# Altium project Battery_Charger_LTC4162.PrjPcb
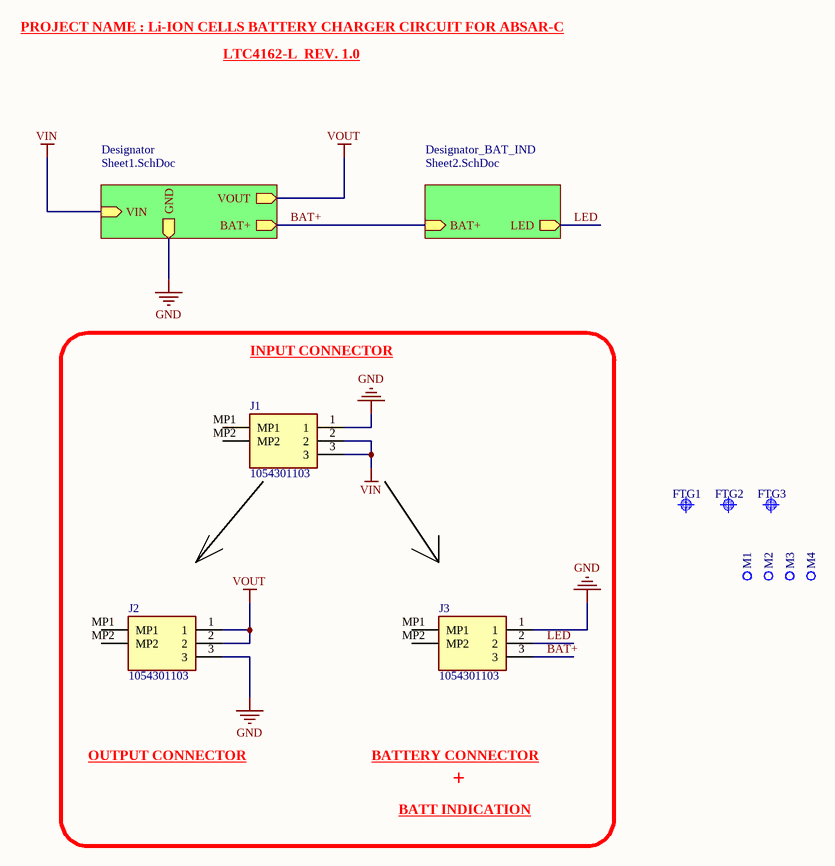
[diagram p0: TOP.SchDoc]
3 sheets, 54 parts. Net scope: hierarchical (ports join the sheet entries above them; power ports are global).
Board files: REV11_PCB_DESIGN_LAYOUT.PcbDoc, Panel_Battery_Charger.PcbDoc
Sheets:
  TOP.SchDoc
    Designator = Sheet1.SchDoc
    Designator_BAT_IND = Sheet2.SchDoc

## Sheet TOP.SchDoc
size A

### Parts
FTG1  Use only in PCB  [Fudicial]  (value not drawn)
FTG2  Use only in PCB  [Fudicial]  (value not drawn)
FTG3  Use only in PCB  [Fudicial]  (value not drawn)
J1  1054301103  [1054301103]
J2  1054301103  [1054301103]
J3  1054301103  [1054301103]
M1  (no value)  [Mounting_pad]
M2  (no value)  [Mounting_pad]
M3  (no value)  [Mounting_pad]
M4  (no value)  [Mounting_pad]

### Blocks framed on the sheet
+: J1-J3

### Sub-sheets
Designator = Sheet1.SchDoc: VIN (in), VOUT (out), GND (out), BAT+ (out)
Designator_BAT_IND = Sheet2.SchDoc: BAT+ (in), LED (out)

### Nets
GND: J1.1 J2.3 J3.1 ; sheet Designator/GND
VIN: J1.2 J1.3 ; sheet Designator/VIN
VOUT: J2.1 J2.2 ; sheet Designator/VOUT
BAT+: J3.3 ; sheet Designator/BAT+, sheet Designator_BAT_IND/BAT+
LED: J3.2 ; sheet Designator_BAT_IND/LED

Not connected (* = marked no-connect by the designer): J1 MP1 MP2; J2 MP1 MP2; J3 MP1 MP2; M1 1; M2 1; M3 1; M4 1

### Notes on the sheet
- PROJECT NAME : Li-ION CELLS BATTERY CHARGER CIRCUIT FOR ABSAR-C
- LTC4162-L  REV. 1.0
- INPUT CONNECTOR
- OUTPUT CONNECTOR
- BATTERY CONNECTOR
- BATT INDICATION

### Library data of the parts
FTG1-FTG3 = Fiducial Target
J1-J3 = 1054301103: Connector; Manufacturer_Name: Molex; Datasheet Link: https://www.molex.com/pdm_docs/sd/1054301103_sd.pdf; Height: 7.19mm; Manufacturer_Part_Number: 1054301103; Mouser Part Number: N/A; Mouser Price/Stock: https://www.mouser.com/Search/Refine.aspx?Keyword=N%2FA
M1-M4 = Through Hole Pad

## Sheet Sheet1.SchDoc
size A
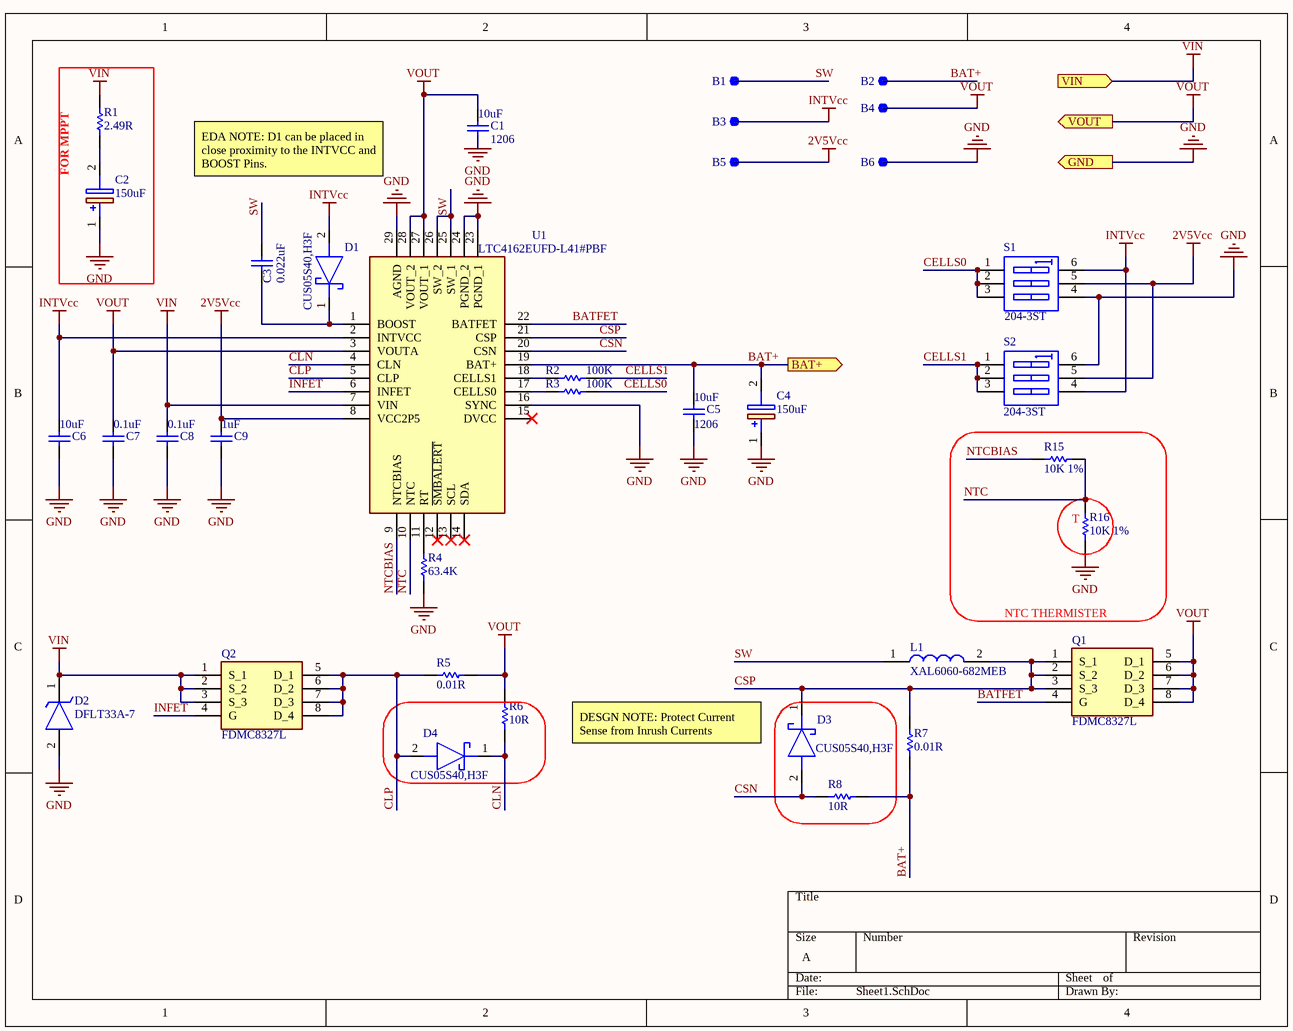
[diagram p1: Sheet1.SchDoc]

### Parts
B1  (no value)  [TPS127]
B2  (no value)  [TPS127]
B3  (no value)  [TPS127]
B4  (no value)  [TPS127]
B5  (no value)  [TPS127]
B6  (no value)  [TPS127]
C1  1206  value 10uF  [CAPC3216X152N]
C2  150uF  [CAPAE1030X1050N]
C3  value 0.022uF  [CAPC1608X80N]  (hidden comment: Cap)
C4  150uF  [CAPAE1030X1050N]
C5  1206  value 10uF  [CAPC3216X152N]
C6  value 10uF  [CAPC1608X80N]  (hidden comment: Cap)
C7  value 0.1uF  [CAPC1608X80N]  (hidden comment: Cap)
C8  value 0.1uF  [CAPC1608X80N]  (hidden comment: Cap)
C9  value 1uF  [CAPC1608X80N]  (hidden comment: Cap)
D1  CUS05S40,H3F  [1SS357TPH3F]
D2  DFLT33A-7  [POWERDI123_1]
D3  CUS05S40,H3F  [1SS357TPH3F]
D4  CUS05S40,H3F  [1SS357TPH3F]
L1  XAL6060-682MEB  [XAL6060822MEB]
Q1  FDMC8327L  [FDMC86139P]
Q2  FDMC8327L  [FDMC86139P]
R1  value 2.49R  [RESC3216X60N]  (hidden comment: Res Semi)
R2  value 100K  [RESC1608X55N]  (hidden comment: Res Semi)
R3  value 100K  [RESC1608X55N]  (hidden comment: Res Semi)
R4  value 63.4K  [RESC1608X55N]  (hidden comment: Res Semi)
R5  value 0.01R  [RESC3216X60N]  (hidden comment: Res Semi)
R6  value 10R  [RESC1608X55N]  (hidden comment: Res Semi)
R7  value 0.01R  [RESC3216X60N]  (hidden comment: Res Semi)
R8  value 10R  [RESC1608X55N]  (hidden comment: Res Semi)
R15  value 10K 1%  [RESC1608X55N]  (hidden comment: Res Semi)
R16  value 10K 1%  [RESC1005X40N]  (hidden comment: Res Semi)
S1  204-3ST  [204-3ST]
S2  204-3ST  [204-3ST]
U1  LTC4162EUFD-L41#PBF  [LTC4162-L]

### Blocks framed on the sheet
FOR MPPT: C2 R1

### Ports
BAT+ (out), GND (out), VIN (in), VOUT (out)

### Nets
2V5Vcc: B5.1 C9.2 S1.5(B2) S2.5(B2) U1.8(VCC2P5)
GND: B6.1 C1.1 C2.1(+) C4.1(+) C5.1 C6.1 C7.1 C8.1 C9.1 D2.2(A) R4.1 R16.2 S1.4(B3) S2.6(B1) U1.16(SYNC) U1.23(PGND_1) U1.24(PGND_2) U1.29(AGND) ; port GND
INTVcc: B3.1 C6.2 D1.2(A) S1.6(B1) S2.4(B3) U1.2(INTVCC)
VIN: C8.2 D2.1(K) Q2.1(S_1) Q2.2(S_2) Q2.3(S_3) R1.2 U1.7(VIN) ; port VIN
VOUT: B4.1 C1.2 C7.2 Q1.5(D_1) Q1.6(D_2) Q1.7(D_3) Q1.8(D_4) R5.1 R6.2 U1.3(VOUTA) U1.27(VOUT_1) U1.28(VOUT_2) ; port VOUT
BAT+: B2.1 C4.2(-) C5.2 R7.2 R8.1 U1.19(BAT+) ; port BAT+
BATFET: Q1.4(G) U1.22(BATFET)
CELLS0: R3.2 S1.1(A1) S1.2(A2) S1.3(A3)
CELLS1: R2.2 S2.1(A1) S2.2(A2) S2.3(A3)
CLN: D4.1(K) R6.1 U1.4(CLN)
CLP: D4.2(A) Q2.5(D_1) Q2.6(D_2) Q2.7(D_3) Q2.8(D_4) R5.2 U1.5(CLP)
CSN: D3.2(A) R8.2 U1.20(CSN)
CSP: D3.1(K) L1.2 Q1.1(S_1) Q1.2(S_2) Q1.3(S_3) R7.1 U1.21(CSP)
INFET: Q2.4(G) U1.6(INFET)
NTC: R15.1 R16.1 U1.10(NTC)
NTCBIAS: R15.2 U1.9(NTCBIAS)
SW: B1.1 C3.1 L1.1 U1.25(SW_1) U1.26(SW_2)
NetC2_2: C2.2(-) R1.1
NetC3_2: C3.2 D1.1(K) U1.1(BOOST)
NetR2_1: R2.1 U1.18(CELLS1)
NetR3_1: R3.1 U1.17(CELLS0)
NetR4_2: R4.2 U1.11(RT)

Not connected (* = marked no-connect by the designer): U1 12(~{SMBALERT})* 13(SCL)* 14(SDA)* 15(DVCC)*

### Notes on the sheet
- EDA NOTE: D1 can be placed in close proximity to the INTVCC and BOOST Pins.
- (near R16) T
- NTC THERMISTER
- (near D3) DESGN NOTE: Protect Current Sense from Inrush Currents

### Library data of the parts
B1-B6 = Single SMD Pad (Round): Through Hole Pad
C1 C3 C5-C9 = Cap: Capacitor; Published: 8-Jun-2000; LatestRevisionDate: 17-Jul-2002; LatestRevisionNote: Re-released for DXP Platform.; PackageReference: RAD-0.3; Publisher: Altium Limited; PackageDescription: Radial Cap, Thru-Hole; 2 Leads; 0.3 in Pin Spacing
C2 C4 = EEEFK1H151P: Capacitor Polarised; Manufacturer_Name: Panasonic; Datasheet Link: http://industrial.panasonic.com/www-cgi/jvcr13pz.cgi?E+PZ+4+ABA0120+EEEFK1H151P+8+WW; Height: 10.5mm; Manufacturer_Part_Number: EEEFK1H151P; Arrow Part Number: EEEFK1H151P
D1 D3 D4 = CUS05S40,H3F: Schottky Diode; Manufacturer_Name: Toshiba; Datasheet Link: http://toshiba.semicon-storage.com/info/docget.jsp?did=14743&prodName=CUS05S40; Height: 1mm; Manufacturer_Part_Number: CUS05S40,H3F; Arrow Part Number: CUS05S40,H3F; Arrow Price/Stock: https://www.arrow.com/en/products/cus05s40h3f/toshiba; Mouser Part Number: 757-CUS05S40H3F; Mouser Price/Stock: https://www.mouser.co.uk/ProductDetail/Toshiba/CUS05S40H3F?qs=cW4DzVrAanNdPcmUvyvUwQ%3D%3D
D2 = DFLT27A-7: TVS Diode (Uni-directional); Manufacturer_Name: Diodes Inc.; Datasheet Link: https://www.diodes.com/assets/Datasheets/ds30581.pdf; Manufacturer_Part_Number: DFLT27A-7; Arrow Part Number: DFLT27A-7; Arrow Price/Stock: https://www.arrow.com/en/products/dflt27a-7/diodes-incorporated; Mouser Part Number: 621-DFLT27A-7; Mouser Price/Stock: https://www.mouser.co.uk/ProductDetail/Diodes-Incorporated/DFLT27A-7?qs=6ARB0lp6jlVvGDG5Fitq6g%3D%3D
L1 = XAL6060-682MEB: Inductor; Manufacturer_Name: COILCRAFT; Datasheet Link: http://www.mouser.com/datasheet/2/597/xal60xx-270658.pdf; Height: 6mm; Manufacturer_Part_Number: XAL6060-682MEB; Arrow Part Number: XAL6060-682MEB; Mouser Part Number: 994-XAL6060-682MEB; Mouser Price/Stock: https://www.mouser.co.uk/ProductDetail/Coilcraft/XAL6060-682MEB?qs=VJjuEbE9QBMHcYJ9tsk61Q%3D%3D
Q1 Q2 = FDMC8327L: MOSFET (N-Channel); Manufacturer_Name: ON Semiconductor; Datasheet Link: https://www.onsemi.com/pub/Collateral/FDMC8327L-D.pdf; Manufacturer_Part_Number: FDMC8327L; Arrow Part Number: FDMC8327L; Arrow Price/Stock: https://www.arrow.com/en/products/fdmc8327l/on-semiconductor; Mouser Part Number: 512-FDMC8327L; Mouser Price/Stock: https://www.mouser.co.uk/ProductDetail/ON-Semiconductor-Fairchild/FDMC8327L?qs=WCuZTSj0%252BHDvMqCYzCnZnA%3D%3D
R1-R8 R15 R16 = Res Semi: Semiconductor Resistor; Published: 8-Jun-2000; LatestRevisionDate: 17-Jul-2002; LatestRevisionNote: Re-released for DXP Platform.; PackageReference: AXIAL-0.5; Publisher: Altium Limited; PackageDescription: Axial Device, Thru-Hole; 2 Leads; 0.5 in Pin Spacing
S1 S2 = SW DIP-3: DIP Switch, 3 Position, SPST; Published: 24-Mar-1999; LatestRevisionDate: 17-Jul-2002; LatestRevisionNote: Re-released for DXP Platform.; PackageReference: DIP-6; Publisher: Altium Limited; Code_JEDEC: MO-001-AM
U1 = LTC4162EUFD-L41#PBF: Integrated Circuit; Manufacturer_Name: Analog Devices; Datasheet Link: https://www.analog.com/media/en/technical-documentation/data-sheets/ltc4162-l.pdf; Height: 0.8mm; Manufacturer_Part_Number: LTC4162EUFD-L41#PBF; Arrow Part Number: LTC4162EUFD-L41#PBF; Arrow Price/Stock: https://www.arrow.com/en/products/ltc4162eufd-l41pbf/analog-devices; Mouser Part Number: 584-4162EUFDL41PB; Mouser Price/Stock: https://www.mouser.com/Search/Refine.aspx?Keyword=584-4162EUFDL41PB

## Sheet Sheet2.SchDoc
size A
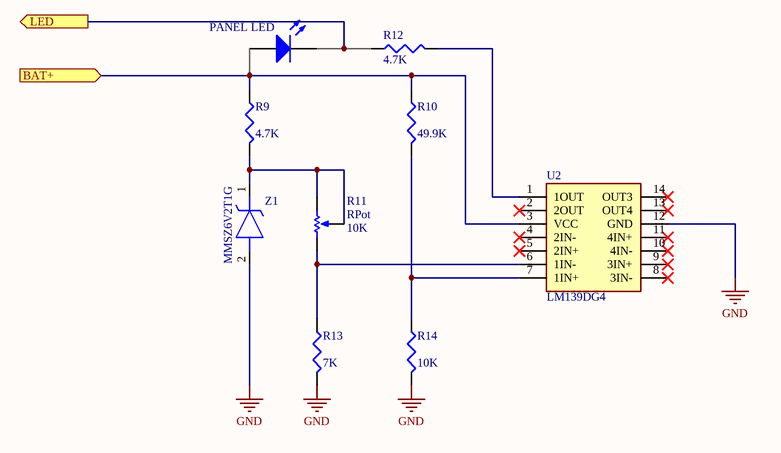
[diagram p2: Sheet2.SchDoc]

### Parts
D5  PANEL LED  [LED-1]  (graphical)
R9  value 4.7K  [RESC1608X55N]  (hidden comment: Res3)
R10  value 49.9K  [RESC1608X55N]  (hidden comment: Res3)
R11  RPot  value 10K  [Bourns_Pot]
R12  value 4.7K  [RESC1608X55N]  (hidden comment: Res3)
R13  value 7K  [RESC1608X55N]  (hidden comment: Res3)
R14  value 10K  [RESC1608X55N]  (hidden comment: Res3)
U2  LM139DG4  [SOIC127P600X175-14N]
Z1  MMSZ6V2T1G  [SOD3716X135N]

### Ports
BAT+ (in), LED (out)

### Nets
GND: R13.2 R14.2 U2.12(GND) Z1.2(A)
BAT+: D5.1(A) R9.1 R10.1 U2.3(VCC) ; port BAT+
LED: D5.2(K) R12.1 ; port LED
NetR9_2: R9.2 R11.2(BOT) R11.3(TAP) Z1.1(K)
NetR10_2: R10.2 R14.1 U2.7(1IN+)
NetR11_1: R11.1(TOP) R13.1 U2.6(1IN-)
NetR12_2: R12.2 U2.1(1OUT)

Not connected (* = marked no-connect by the designer): U2 2(2OUT)* 4(2IN-)* 5(2IN+)* 8(3IN-)* 9(3IN+)* 10(4IN-)* 11(4IN+)* 13(OUT4)* 14(OUT3)*

### Library data of the parts
D5 = LED3: Typical BLUE SiC LED; Published: 8-Jun-2000; LatestRevisionDate: 17-Dec-2003; LatestRevisionNote: PCB Footprint replaced.; DatasheetVersion: 16-Apr-2002; PackageVersion: 16-Apr-2002; PackageReference: 3.5X2.8X1.9; Publisher: Altium Limited; PackageDescription: SM LED; 2 C-Bend Leads; Body 3.5 x 2.8 x 1.9 mm, inc leads (LxWxH typ)
R9 R10 R12-R14 = Res3: Resistor; Published: 8-Jun-2000; LatestRevisionDate: 29-May-2009; LatestRevisionNote: IPC-7351 Footprint Added.; PackageReference: J1-0603; Publisher: Altium Limited; PackageDescription: Chip Resistor
R11 = RPot: Potentiometer; Sim Note: Enter the Resistance value and the set point into parameter fields.; Set Position: 0.5; Published: 8-Jun-2000; LatestRevisionDate: 17-Jul-2002; LatestRevisionNote: Re-released for DXP Platform.; PackageReference: VR5; Publisher: Altium Limited; PackageDescription: Variable Resistor, Thru-Hole; 3 Leads
U2 = LM139DG4: Integrated Circuit; Manufacturer_Name: Texas Instruments; Datasheet Link: http://www.ti.com/lit/gpn/lm139; Height: 1.75mm; Manufacturer_Part_Number: LM139DG4; Arrow Part Number: LM139DG4; Arrow Price/Stock: https://www.arrow.com/en/products/lm139dg4/texas-instruments; Mouser Part Number: 595-LM139DG4; Mouser Price/Stock: https://www.mouser.co.uk/ProductDetail/Texas-Instruments/LM139DG4?qs=pZC5fsuWujF2%252BfnPhylc7Q%3D%3D
Z1 = MMSZ6V2T1G: Zener Diode; Manufacturer_Name: ON Semiconductor; Datasheet Link: http://www.onsemi.com/pub/Collateral/MMSZ2V4T1-D.PDF; Height: 1.35mm; Manufacturer_Part_Number: MMSZ6V2T1G; Arrow Part Number: MMSZ6V2T1G; Arrow Price/Stock: https://www.arrow.com/en/products/mmsz6v2t1g/on-semiconductor; Mouser Part Number: 863-MMSZ6V2T1G; Mouser Price/Stock: https://www.mouser.com/Search/Refine.aspx?Keyword=863-MMSZ6V2T1G

## Nets that join several sheets
GND: TOP (J1.1 J2.3 J3.1), Sheet1 (18 pins), Sheet2 (R13.2 R14.2 U2.12 Z1.2)
VIN: TOP (J1.2 J1.3), Sheet1 (7 pins)
VOUT: TOP (J2.1 J2.2), Sheet1 (12 pins)
BAT+: TOP (J3.3), Sheet1 (6 pins), Sheet2 (D5.1 R9.1 R10.1 U2.3)
LED: TOP (J3.2), Sheet2 (D5.2 R12.1)